# EAGLE design Panel (EAGLE 7.1.0)
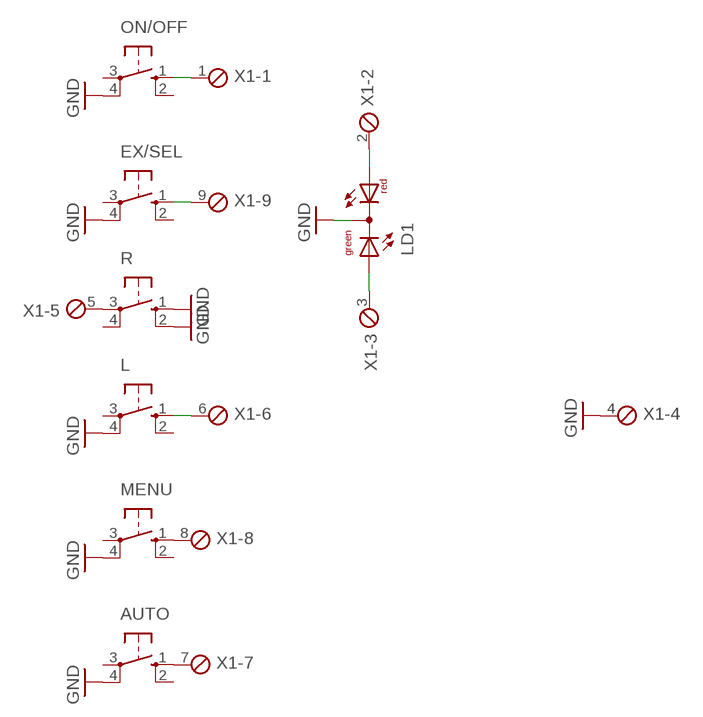
[diagram p0: schematic, sheet 1]

## Parts
AUTO  10-XX  [B3F-10XX]
EX/SEL  10-XX  [B3F-10XX]
L  10-XX  [B3F-10XX]
LD1  DUOLED-RG-C  [DUOLED-C-5MM]
MENU  10-XX  [B3F-10XX]
ON/OFF  10-XX  [B3F-10XX]
R  10-XX  [B3F-10XX]
X1  MPT9  [9POL254]

## Nets
GND: AUTO.4(P1) EX/SEL.4(P1) L.4(P1) LD1.C MENU.4(P1) ON/OFF.4(P1) R.1(S) R.2(S1) X1.4
N$1: ON/OFF.1(S) X1.1
N$2: LD1.AR X1.2
N$3: LD1.AX(AG) X1.3
N$4: EX/SEL.1(S) X1.9
N$5: R.3(P) X1.5
N$6: L.1(S) X1.6
N$7: MENU.1(S) X1.8
N$8: AUTO.1(S) X1.7
Unconnected: AUTO.2(S1) AUTO.3(P) EX/SEL.2(S1) EX/SEL.3(P) L.2(S1) L.3(P) MENU.2(S1) MENU.3(P) ON/OFF.2(S1) ON/OFF.3(P) R.4(P1)

## Library data of the parts
AUTO EX/SEL L MENU ON/OFF R = switch-omron:10-XX: OMRON SWITCH; MPN: B3F-1000; OC_FARNELL: 176432; OC_NEWARK: 36M3542
LD1 = led:DUOLED-RG-C: DUO LED 2 colors (red/green), 5 mm, round, common Cathode www.ligitek.com or other producers.
X1 = con-phoenix-254:MPT9: PHOENIX CONNECTOR; OC_FARNELL: unknown; OC_NEWARK: unknown

## Board
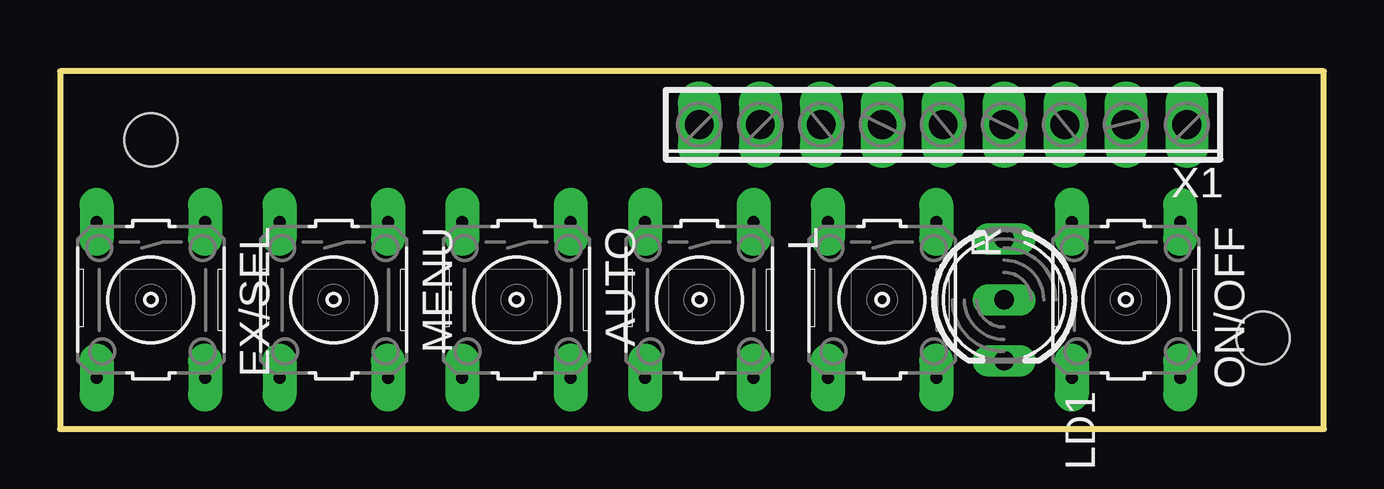
[diagram p1: board, top side]
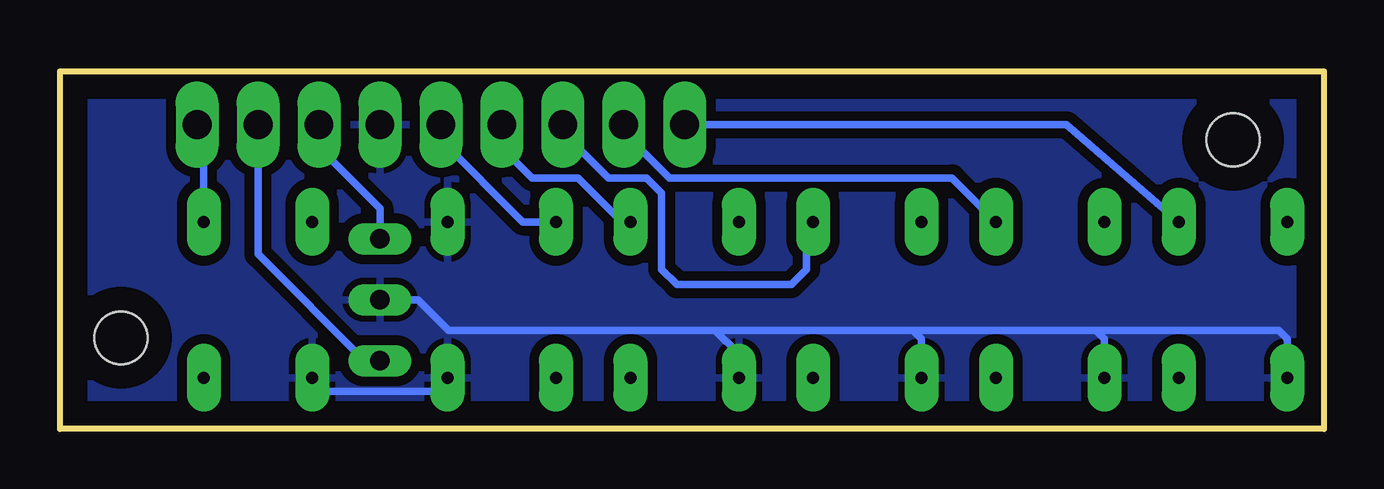
[diagram p2: board, bottom side, seen from below]

Size 52.68 x 14.91 mm. Coordinates in mm from the lower left corner, seen from the top.
Outline: 52.68,14.91 0,14.91 0,0 52.68,0 52.68,14.91
Copper layers (1*16): Top 0.035mm / dielectric 1.5mm / Bottom 0.035mm
Design rules "default": minimum track width 10mil, minimum drill 24mil, track to track 8mil, track to pad 8mil, pad to pad 8mil, via to via 8mil, smd to smd 8mil, copper to edge 40mil, drill to drill 8mil, minimum pad ring 10mil, minimum via ring 8mil, stop-mask expansion 4mil, vias tented up to drill 0mil, thermal gap 10mil
Holes 2.2 mm at 3.79,12.05 50.14,3.8

### Footprints (pad centres in the part's own frame; a part is rotated, then mirrored left to right if it is on the bottom)
B3F-10XX = drill 0.5 pad 1.422 long: 1 -3.251,2.261; 2 3.251,2.261; 3 -3.251,-2.261; 4 3.251,-2.261
DUOLED-C-5MM = drill 0.813 long: AR 2.54,0; AX -2.54,0; C 0,0
9POL254 = drill 1.2 long: 1 -10.16,0; 2 -7.62,0; 3 -5.08,0; 4 -2.54,0; 5 0,0; 6 2.54,0; 7 5.08,0; 8 7.62,0; 9 10.16,0

### Placement (x,y rotation side)
AUTO  19.03,5.38 270 top
EX/SEL  3.79,5.38 270 top
L  26.65,5.38 270 top
LD1  39.35,5.38 270 top
MENU  11.41,5.38 270 top
ON/OFF  44.43,5.38 270 top
R  34.27,5.38 270 top
X1  36.81,12.69 180 top

### Tracks (layer width: path | path; a pad name or v marks a point on that pad's centre or on a via)
GND
  Bottom 0.305: LD1.C 37.76,5.39 36.49,4.12 25.38,4.12 | ON/OFF.4 42.17,1.85 41.89,1.58 37.09,1.58 36.49,2.17 | L.4 24.39,3.12 25.38,4.12 | AUTO.4 16.77,3.76 17.12,4.12 | 17.12,4.12 25.38,4.12 | MENU.4 9.15,3.76 9.51,4.12 | 9.51,4.12 17.12,4.12 | EX/SEL.4 1.53,3.76 1.89,4.12 9.51,4.12
  pour Bottom (isolate 0.406): -0.02,15.23 -0.02,-0.01 53.32,-0.01 53.32,15.23
N$1
  Bottom 0.305: ON/OFF.1 46.69,12.41 X1.1
N$2
  Bottom 0.305: LD1.AR 39.98,2.85 44.43,7.29 X1.2
N$3
  Bottom 0.305: X1.3 41.89,11.74 39.35,9.19 LD1.AX
N$4
  Bottom 0.305: X1.9 10.74,12.69 EX/SEL.1
N$5
  Bottom 0.305: X1.5 36.81,12.05 33.39,8.64 R.3
N$6
  Bottom 0.305: X1.6 34.27,11.74 33,10.46 31.09,10.46 29.19,8.56 | 28.99,8.56 L.1
  Bottom 0.406: 29.19,8.56 28.99,8.56
N$7
  Bottom 0.305: 29.19,12.37 27.29,10.46 15.5,10.46 MENU.1
  Bottom 0.406: X1.8 29.19,12.37
N$8
  Bottom 0.305: X1.7 31.09,11.74 29.82,10.46 28.24,10.46 27.6,9.83 27.6,6.65 26.97,6.02 22.21,6.02 21.57,6.65 21.57,8.36 AUTO.1